# Altium schematic sheet Motor_Controller.SchDoc
size A4
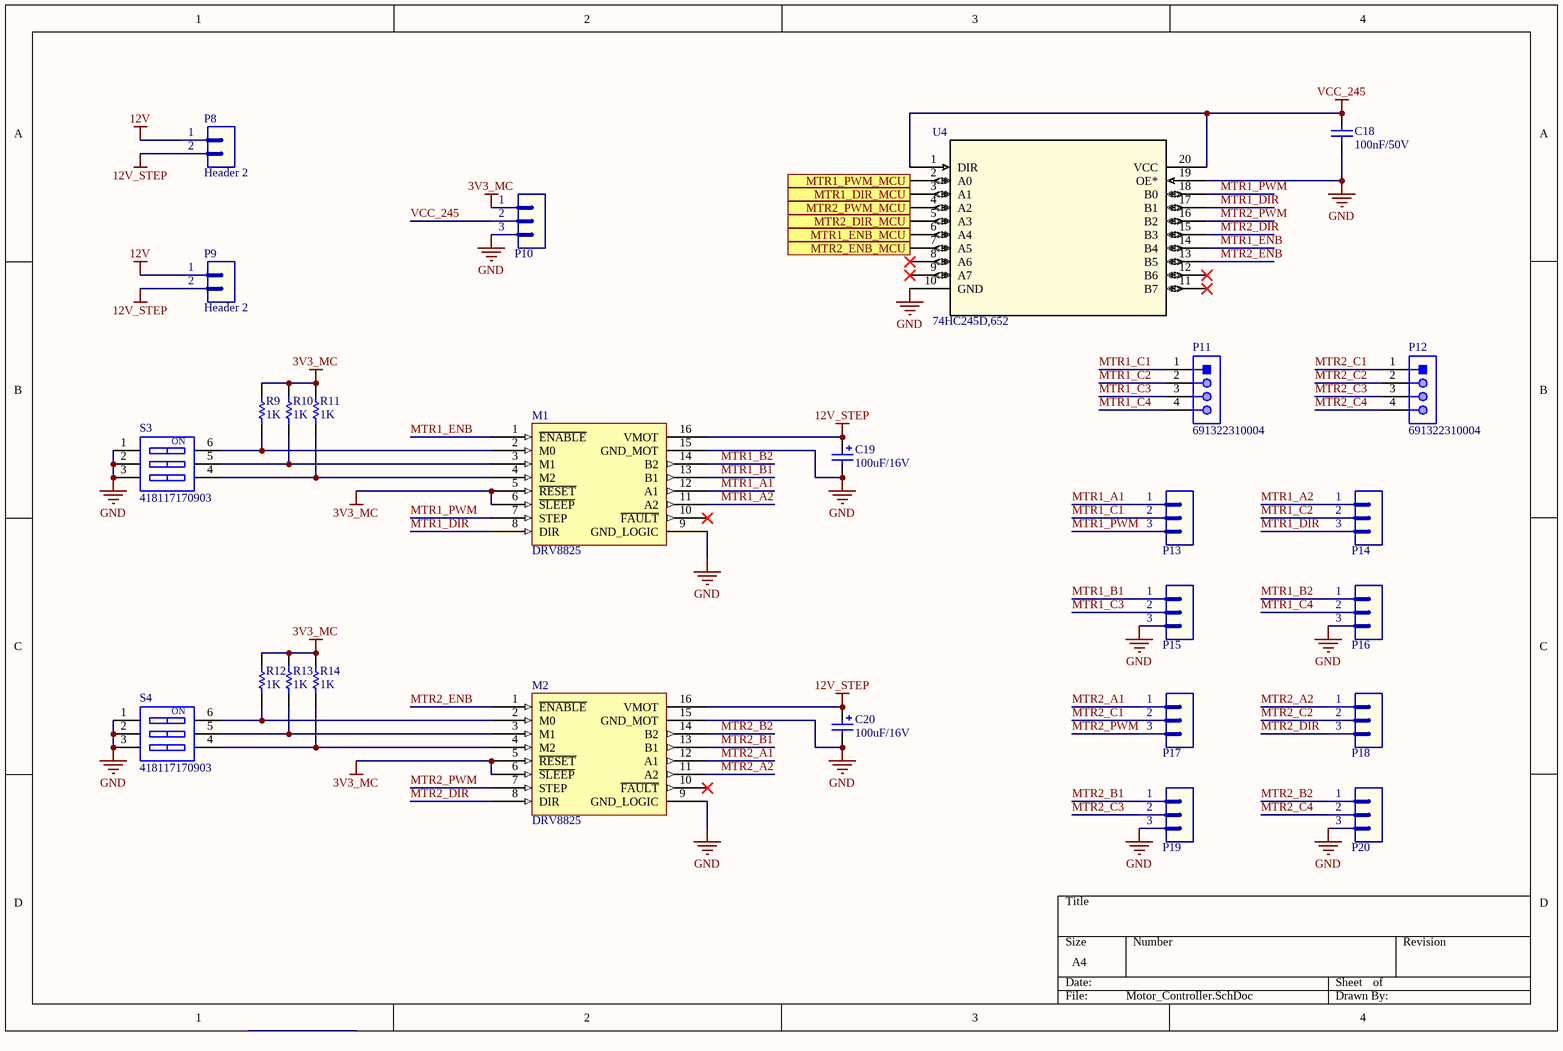
[diagram p0: Motor_Controller.SchDoc]

## Parts
C18  value 100nF/50V  [CAP-SM-0805]  (hidden comment: Cap-100nF-50V-0805)
C19  value 100uF/16V  [CAP-SM-AL-SIZE-D-D6L6]  (hidden comment: Cap-Al-100uF-16V-D6L5)
C20  value 100uF/16V  [CAP-SM-AL-SIZE-D-D6L6]  (hidden comment: Cap-Al-100uF-16V-D6L5)
M1  DRV8825  [IC_DRV8825_STEPPER_MOTOR_DRIVER_CARRIER]
M2  DRV8825  [IC_DRV8825_STEPPER_MOTOR_DRIVER_CARRIER]
P8  Header 2  [JP2]
P9  Header 2  [JP2]
P10  Header 3  [JP3]  (value not drawn)
P11  691322310004  [691322310004]
P12  691322310004  [691322310004]
P13  Header 3  [JP3]  (value not drawn)
P14  Header 3  [JP3]  (value not drawn)
P15  Header 3  [JP3]  (value not drawn)
P16  Header 3  [JP3]  (value not drawn)
P17  Header 3  [JP3]  (value not drawn)
P18  Header 3  [JP3]  (value not drawn)
P19  Header 3  [JP3]  (value not drawn)
P20  Header 3  [JP3]  (value not drawn)
R9  value 1K  [RES-SM-0805]  (hidden comment: Res-1K-0805)
R10  value 1K  [RES-SM-0805]  (hidden comment: Res-1K-0805)
R11  value 1K  [RES-SM-0805]  (hidden comment: Res-1K-0805)
R12  value 1K  [RES-SM-0805]  (hidden comment: Res-1K-0805)
R13  value 1K  [RES-SM-0805]  (hidden comment: Res-1K-0805)
R14  value 1K  [RES-SM-0805]  (hidden comment: Res-1K-0805)
S3  418117170903  [418117170903]
S4  418117170903  [418117170903]
U4  74HC245D,652  [SOT163-1_NEX]

## Ports
MTR1_DIR_MCU (in), MTR1_ENB_MCU (in), MTR1_PWM_MCU (in), MTR2_DIR_MCU (in), MTR2_ENB_MCU (in), MTR2_PWM_MCU (in)

## Nets
3V3_MC: M1.5(~{RESET}) M1.6(~{SLEEP}) M2.5(~{RESET}) M2.6(~{SLEEP}) P10.1 R9.1 R10.1 R11.1 R12.1 R13.1 R14.1
12V: P8.1 P9.1
12V_STEP: C19.1 C20.1 M1.16(VMOT) M2.16(VMOT) P8.2 P9.2
GND: C18.1 C19.2 C20.2 M1.9(GND_LOGIC) M1.15(GND_MOT) M2.9(GND_LOGIC) M2.15(GND_MOT) P10.3 P15.3 P16.3 P19.3 P20.3 S3.1 S3.2 S3.3 S4.1 S4.2 S4.3 U4.10(GND) U4.19(OE*)
VCC_245: C18.2 P10.2 U4.1(DIR) U4.20(VCC)
MTR1_A1: M1.12(A1) P13.1
MTR1_A2: M1.11(A2) P14.1
MTR1_B1: M1.13(B1) P15.1
MTR1_B2: M1.14(B2) P16.1
MTR1_C1: P11.1 P13.2
MTR1_C2: P11.2 P14.2
MTR1_C3: P11.3 P15.2
MTR1_C4: P11.4 P16.2
MTR1_DIR: M1.8(DIR) P14.3 U4.17(B1)
MTR1_DIR_MCU: U4.3(A1) ; port MTR1_DIR_MCU
MTR1_ENB: M1.1(~{ENABLE}) U4.14(B4)
MTR1_ENB_MCU: U4.6(A4) ; port MTR1_ENB_MCU
MTR1_PWM: M1.7(STEP) P13.3 U4.18(B0)
MTR1_PWM_MCU: U4.2(A0) ; port MTR1_PWM_MCU
MTR2_A1: M2.12(A1) P17.1
MTR2_A2: M2.11(A2) P18.1
MTR2_B1: M2.13(B1) P19.1
MTR2_B2: M2.14(B2) P20.1
MTR2_C1: P12.1 P17.2
MTR2_C2: P12.2 P18.2
MTR2_C3: P12.3 P19.2
MTR2_C4: P12.4 P20.2
MTR2_DIR: M2.8(DIR) P18.3 U4.15(B3)
MTR2_DIR_MCU: U4.5(A3) ; port MTR2_DIR_MCU
MTR2_ENB: M2.1(~{ENABLE}) U4.13(B5)
MTR2_ENB_MCU: U4.7(A5) ; port MTR2_ENB_MCU
MTR2_PWM: M2.7(STEP) P17.3 U4.16(B2)
MTR2_PWM_MCU: U4.4(A2) ; port MTR2_PWM_MCU
NetM1_2: M1.2(M0) R9.2 S3.6
NetM1_3: M1.3(M1) R10.2 S3.5
NetM1_4: M1.4(M2) R11.2 S3.4
NetM2_2: M2.2(M0) R12.2 S4.6
NetM2_3: M2.3(M1) R13.2 S4.5
NetM2_4: M2.4(M2) R14.2 S4.4

Not connected (* = marked no-connect by the designer): M1 10(~{FAULT})*; M2 10(~{FAULT})*; U4 8(A6)* 9(A7)* 11(B7)* 12(B6)*

## Notes on the sheet
- (in symbol 418117170903) ON

## Library data of the parts
C18 = Cap-100nF-50V-0805: CAP CER 0.1UF 50V Y5V 0805; Manufacturer: Samsung Electro-Mechanics; Manufacturer Part Number: CL21F104ZBCNNNC; Local Supplier: thegioiic; Local Supplier Link: https://thegioiic.com/products/tu-100nf-0-1uf-50v-0805; Supplier 1: Digikey; Supplier 1 Part Number: 1276-1007-1-ND; Supplier 1 Link: https://www.digikey.com/product-detail/en/samsung-electro-mechanics/CL21F104ZBCNNNC/1276-1007-1-ND/3889093
C19 C20 = Cap-Al-100uF-16V-D6L5: CAP ALUM 100UF 20% 16V SMD; Manufacturer: Nichicon; Manufacturer Part Number: UWX1C101MCL1GB; Local Supplier: thegioiic; Local Supplier Link: https://thegioiic.com/products/tu-nhom-smd-100uf-16v-d6-3l5-4; Supplier 1: Digikey; Supplier 1 Part Number: 493-2105-1-ND; Supplier 1 Link: https://www.digikey.com/product-detail/en/nichicon/UWX1C101MCL1GB/493-2105-1-ND/590080
P8 P9 = Header 2: Header, 2-Pin; LatestRevisionDate: 17-Jul-2002; LatestRevisionNote: Re-released for DXP Platform.; Publisher: Altium Limited
P10 P13-P20 = Header 3: Header, 3-Pin; LatestRevisionDate: 17-Jul-2002; LatestRevisionNote: Re-released for DXP Platform.; Publisher: Altium Limited
P11 P12 = 691322310004: WR-TBL Serie 322 Horizontal PCB Header, Pluggable, pitch 3.81mm, 4p; Compliance: RoHS; Modularity: No; Pin Number: 4; Rated Current [UL]: 10A; Working Voltage [UL]: 300VAC; ComponentLink1Description: Manufacturer; ComponentLink1URL: http://www.we-online.de; ComponentLink2URL: https://katalog.we-online.de/em/datasheet/691322310004.pdf; ComponentLink2Description: Datasheet; Mounting Technology: THT; Part Number: 691322310004; Packaging: Box; Operating Temperature: -40 to +105degC; PCB/Cable/Panel: PCB; Pitch: 3.81mm; Published Date: October 2019; Type: Horizontal; Publisher: Wurth Elektronik; Application: Pluggable
R9-R14 = Res-1K-0805: RES 1K OHM 1% 1/4W 0805; Manufacturer: Stackpole Electronics Inc; Manufacturer Part Number: RNCP0805FTD1K00; Local Supplier: thegioiic; Local Supplier Link: https://thegioiic.com/products/dien-tro-1k-ohm-0805-5; Supplier 1: Digikey; Supplier 1 Link: https://www.digikey.com/product-detail/en/stackpole-electronics-inc/RNCP0805FTD1K00/RNCP0805FTD1K00CT-ND/2240568; Supplier 1 Part Number: RNCP0805FTD1K00CT-ND
S3 S4 = 418117170903: WS-DITV Compact THT Dip Switch, Flat Actuator, pitch 2.54mm, 3p; Operation Force: 800g; Pole Number: 3; Actuator Type: Flat Type; Circuit: SPST-NO; Rated Current Switching: 25mA; Rated Current Non-Switching: 100mA; Rated Voltage Non-Switching: 50VDC; Rated Voltage Switching: 24VDC; ComponentLink1Description: Manufacturer; ComponentLink1URL: http://www.we-online.de; ComponentLink2Description: Datasheet; ComponentLink2URL: https://katalog.we-online.com/em/datasheet/418117170903.pdf; Pitch: 2.54mm; Contact Material: Copper Alloy; Mounting Technology: THT; Operating Temperature: -40 to +85degC; Contact Plating: Gold; Packaging: Tube; Part Number: 418117170903; Publisher: Wurth Elektronik; Published Date: September 2019
U4 = 74HC245D,652: No Description Available; Vendor: Nexperia; SourceLibrary: Nexperia_2018-05-2018; Manufacturer_Part_Number: 74HC245D,652; Copyright: Copyright (C) 2016 Accelerated Designs. All rights reserved; RefDes: RefDes; Type: DEV